# Altium schematic sheet FP2_A_TTypeFBTxs.SchDoc
size A3; SheetNumber: 1; SheetTotal: 1
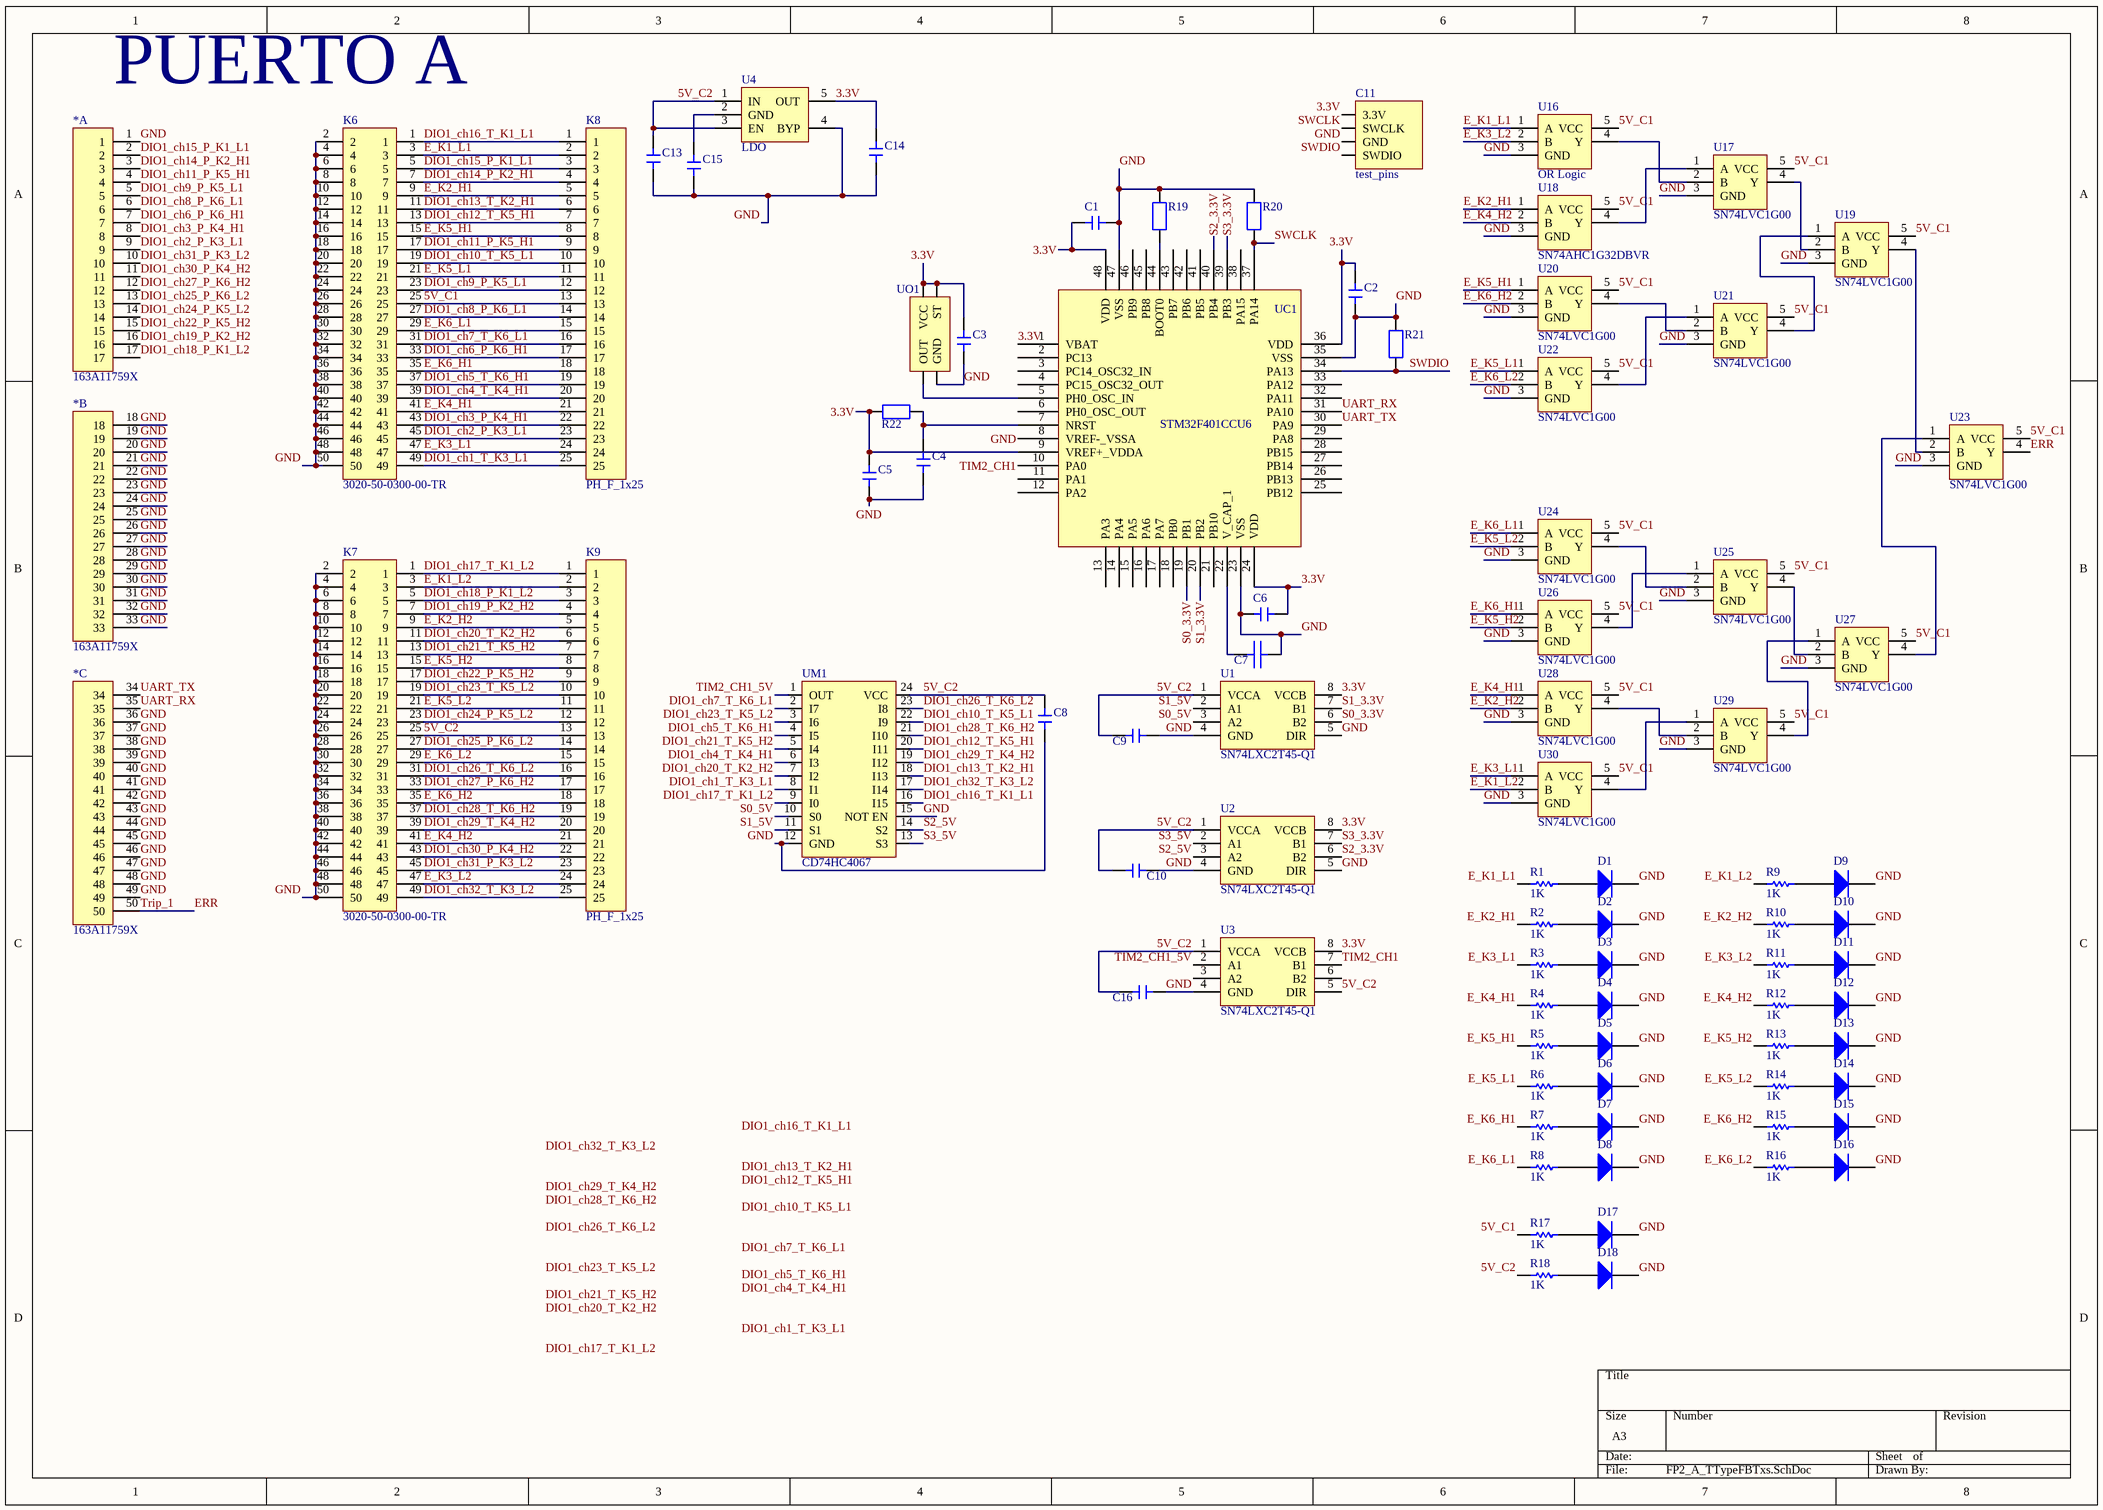
[diagram p0: FP2_A_TTypeFBTxs.SchDoc]

## Parts
(Parts that share a designator on the sheet are numbered #1, #2 ... from top to bottom, then left to right.)
*#1  163A11759X  [163A11759X]  (part A of 3)
*#2  163A11759X  [163A11759X]  (part B of 3)
*#3  163A11759X  [163A11759X]  (part C of 3)
C1  C_100nF  [CAPC1005X02N]  (value not drawn)
C2  C_100nF  [CAPC1005X02N]  (value not drawn)
C3  C_100nF  [CAPC1005X02N]  (value not drawn)
C4  C_100nF  [CAPC1005X02N]  (value not drawn)
C5  C_100nF  [CAPC1005X02N]  (value not drawn)
C6  C_100nF  [CAPC1005X02N]  (value not drawn)
C7  C_4.7uF  [CAPC1005X02N]  (value not drawn)
C8  C_100nF  [CAPC1005X02N]  (value not drawn)
C9  C_100nF  [CAPC1005X02N]  (value not drawn)
C10  C_100nF  [CAPC1005X02N]  (value not drawn)
C11  test_pins  [Test_pins]
C13  C_100nF  [CAPC1005X02N]  (value not drawn)
C14  C_100nF  [CAPC1005X02N]  (value not drawn)
C15  C_100nF  [CAPC1005X02N]  (value not drawn)
C16  C_100nF  [CAPC1005X02N]  (value not drawn)
D1  Diode  (value not drawn)
D2  Diode  (value not drawn)
D3  Diode  (value not drawn)
D4  Diode  (value not drawn)
D5  Diode  (value not drawn)
D6  Diode  (value not drawn)
D7  Diode  (value not drawn)
D8  Diode  (value not drawn)
D9  Diode  (value not drawn)
D10  Diode  (value not drawn)
D11  Diode  (value not drawn)
D12  Diode  (value not drawn)
D13  Diode  (value not drawn)
D14  Diode  (value not drawn)
D15  Diode  (value not drawn)
D16  Diode  (value not drawn)
D17  Diode  (value not drawn)
D18  Diode  (value not drawn)
K6  3020-50-0300-00-TR  [IDC_2x50]
K7  3020-50-0300-00-TR  [IDC_2x50]
K8  PH_F_1x25  [PH_F_1x25]
K9  PH_F_1x25  [PH_F_1x25]
R1  value 1K  (hidden comment: Resistor)
R2  value 1K  (hidden comment: Resistor)
R3  value 1K  (hidden comment: Resistor)
R4  value 1K  (hidden comment: Resistor)
R5  value 1K  (hidden comment: Resistor)
R6  value 1K  (hidden comment: Resistor)
R7  value 1K  (hidden comment: Resistor)
R8  value 1K  (hidden comment: Resistor)
R9  value 1K  (hidden comment: Resistor)
R10  value 1K  (hidden comment: Resistor)
R11  value 1K  (hidden comment: Resistor)
R12  value 1K  (hidden comment: Resistor)
R13  value 1K  (hidden comment: Resistor)
R14  value 1K  (hidden comment: Resistor)
R15  value 1K  (hidden comment: Resistor)
R16  value 1K  (hidden comment: Resistor)
R17  value 1K  (hidden comment: Resistor)
R18  value 1K  (hidden comment: Resistor)
R19  R_40kOhm  [Resist]  (value not drawn)
R20  R_40kOhm  [Resist]  (value not drawn)
R21  R_40kOhm  [Resist]  (value not drawn)
R22  R_40kOhm  [Resist]  (value not drawn)
U1  SN74LXC2T45-Q1  [SN74LXC2T45-Q1]
U2  SN74LXC2T45-Q1  [SN74LXC2T45-Q1]
U3  SN74LXC2T45-Q1  [SN74LXC2T45-Q1]
U4  LDO  [LDK120-5N-200mA]
U16  OR Logic  [sot23]
U17  SN74LVC1G00  [sot23]
U18  SN74AHC1G32DBVR  [sot23]
U19  SN74LVC1G00  [sot23]
U20  SN74LVC1G00  [sot23]
U21  SN74LVC1G00  [sot23]
U22  SN74LVC1G00  [sot23]
U23  SN74LVC1G00  [sot23]
U24  SN74LVC1G00  [sot23]
U25  SN74LVC1G00  [sot23]
U26  SN74LVC1G00  [sot23]
U27  SN74LVC1G00  [sot23]
U28  SN74LVC1G00  [sot23]
U29  SN74LVC1G00  [sot23]
U30  SN74LVC1G00  [sot23]
UC1  STM32F401CCU6  [STM32F401CCU6-UFQFPN48]
UM1  CD74HC4067  [CD74HC4067SM96]
UO1  Oscil SG-210STF 25MHz  [SG-210STF-25.0000M]  (value not drawn)

## Nets
3.3V: C1.1 C2.2 C3.2 C5.2 C6.1 C11.1(3.3V) C14.1 R22.2 U1.8(VCCB) U2.8(VCCB) U3.8(VCCB) U4.5(OUT) UC1.1(VBAT) UC1.9(VREF+_VDDA) UC1.24(VDD) UC1.36(VDD) UC1.48(VDD) UO1.1(ST) UO1.4(VCC)
5V_C1: K6.25 K8.13 R17.1 U16.5(VCC) U17.5(VCC) U18.5(VCC) U19.5(VCC) U20.5(VCC) U21.5(VCC) U22.5(VCC) U23.5(VCC) U24.5(VCC) U25.5(VCC) U26.5(VCC) U27.5(VCC) U28.5(VCC) U29.5(VCC) U30.5(VCC)
5V_C2: C8.1 C9.2 C10.2 C13.1 C16.2 K7.25 K9.13 R18.1 U1.1(VCCA) U2.1(VCCA) U3.1(VCCA) U3.5(DIR) U4.1(IN) U4.3(EN) UM1.24(VCC)
DIO1_ch1_T_K3_L1: K6.49 K8.25 UM1.8(I1)
DIO1_ch2_P_K3_L1: *#1.9 K6.45 K8.23
DIO1_ch3_P_K4_H1: *#1.8 K6.43 K8.22
DIO1_ch4_T_K4_H1: K6.39 K8.20 UM1.6(I3)
DIO1_ch5_T_K6_H1: K6.37 K8.19 UM1.4(I5)
DIO1_ch6_P_K6_H1: *#1.7 K6.33 K8.17
DIO1_ch7_T_K6_L1: K6.31 K8.16 UM1.2(I7)
DIO1_ch8_P_K6_L1: *#1.6 K6.27 K8.14
DIO1_ch9_P_K5_L1: *#1.5 K6.23 K8.12
DIO1_ch10_T_K5_L1: K6.19 K8.10 UM1.22(I9)
DIO1_ch11_P_K5_H1: *#1.4 K6.17 K8.9
DIO1_ch12_T_K5_H1: K6.13 K8.7 UM1.20(I11)
DIO1_ch13_T_K2_H1: K6.11 K8.6 UM1.18(I13)
DIO1_ch14_P_K2_H1: *#1.3 K6.7 K8.4
DIO1_ch15_P_K1_L1: *#1.2 K6.5 K8.3
DIO1_ch16_T_K1_L1: K6.1 K8.1 UM1.16(I15)
DIO1_ch17_T_K1_L2: K7.1 K9.1 UM1.9(I0)
DIO1_ch18_P_K1_L2: *#1.17 K7.5 K9.3
DIO1_ch19_P_K2_H2: *#1.16 K7.7 K9.4
DIO1_ch20_T_K2_H2: K7.11 K9.6 UM1.7(I2)
DIO1_ch21_T_K5_H2: K7.13 K9.7 UM1.5(I4)
DIO1_ch22_P_K5_H2: *#1.15 K7.17 K9.9
DIO1_ch23_T_K5_L2: K7.19 K9.10 UM1.3(I6)
DIO1_ch24_P_K5_L2: *#1.14 K7.23 K9.12
DIO1_ch25_P_K6_L2: *#1.13 K7.27 K9.14
DIO1_ch26_T_K6_L2: K7.31 K9.16 UM1.23(I8)
DIO1_ch27_P_K6_H2: *#1.12 K7.33 K9.17
DIO1_ch28_T_K6_H2: K7.37 K9.19 UM1.21(I10)
DIO1_ch29_T_K4_H2: K7.39 K9.20 UM1.19(I12)
DIO1_ch30_P_K4_H2: *#1.11 K7.43 K9.22
DIO1_ch31_P_K3_L2: *#1.10 K7.45 K9.23
DIO1_ch32_T_K3_L2: K7.49 K9.25 UM1.17(I14)
E_K1_L1: K6.3 K8.2 R1.1 U16.1(A)
E_K1_L2: K7.3 K9.2 R9.1 U30.2(B)
E_K2_H1: K6.9 K8.5 R2.1 U18.1(A)
E_K2_H2: K7.9 K9.5 R10.1 U28.2(B)
E_K3_L1: K6.47 K8.24 R3.1 U30.1(A)
E_K3_L2: K7.47 K9.24 R11.1 U16.2(B)
E_K4_H1: K6.41 K8.21 R4.1 U28.1(A)
E_K4_H2: K7.41 K9.21 R12.1 U18.2(B)
E_K5_H1: K6.15 K8.8 R5.1 U20.1(A)
E_K5_H2: K7.15 K9.8 R13.1 U26.2(B)
E_K5_L1: K6.21 K8.11 R6.1 U22.1(A)
E_K5_L2: K7.21 K9.11 R14.1 U24.2(B)
E_K6_H1: K6.35 K8.18 R7.1 U26.1(A)
E_K6_H2: K7.35 K9.18 R15.1 U20.2(B)
E_K6_L1: K6.29 K8.15 R8.1 U24.1(A)
E_K6_L2: K7.29 K9.15 R16.1 U22.2(B)
ERR: *#3.50 U23.4(Y)  [also labelled Trip_1]
GND: *#1.1 *#2.18 *#2.19 *#2.20 *#2.21 *#2.22 *#2.23 *#2.24 *#2.25 *#2.26 *#2.27 *#2.28 *#2.29 *#2.30 *#2.31 *#2.32 *#2.33 *#3.36 *#3.37 *#3.38 *#3.39 *#3.40 *#3.41 *#3.42 *#3.43 *#3.44 *#3.45 *#3.46 *#3.47 *#3.48 *#3.49 C1.2 C2.1 C3.1 C4.1 C5.1 C6.2 C7.2 C8.2 C9.1 C10.1 C11.3(GND) C13.2 C14.2 C15.2 C16.1 D1.2(K) D2.2(K) D3.2(K) D4.2(K) D5.2(K) D6.2(K) D7.2(K) D8.2(K) D9.2(K) D10.2(K) D11.2(K) D12.2(K) D13.2(K) D14.2(K) D15.2(K) D16.2(K) D17.2(K) D18.2(K) K6.2 K6.4 K6.6 K6.8 K6.10 K6.12 K6.14 K6.16 K6.18 K6.20 K6.22 K6.24 K6.26 K6.28 K6.30 K6.32 K6.34 K6.36 K6.38 K6.40 K6.42 K6.44 K6.46 K6.48 K6.50 K7.2 K7.4 K7.6 K7.8 K7.10 K7.12 K7.14 K7.16 K7.18 K7.20 K7.22 K7.24 K7.26 K7.28 K7.30 K7.32 K7.34 K7.36 K7.38 K7.40 K7.42 K7.44 K7.46 K7.48 K7.50 R19.2 R20.2 R21.2 U1.4(GND) U1.5(DIR) U2.4(GND) U2.5(DIR) U3.4(GND) U4.4(BYP) U16.3(GND) U17.3(GND) U18.3(GND) U19.3(GND) U20.3(GND) U21.3(GND) U22.3(GND) U23.3(GND) U24.3(GND) U25.3(GND) U26.3(GND) U27.3(GND) U28.3(GND) U29.3(GND) U30.3(GND) UC1.8(VREF-_VSSA) UC1.23(VSS) UC1.35(VSS) UC1.47(VSS) UM1.12(GND) UM1.15(NOT_EN) UO1.2(GND)
S0_3.3V: U1.6(B2) UC1.19(PB1)
S0_5V: U1.3(A2) UM1.10(S0)
S1_3.3V: U1.7(B1) UC1.20(PB2)
S1_5V: U1.2(A1) UM1.11(S1)
S2_3.3V: U2.6(B2) UC1.40(PB4)
S2_5V: U2.3(A2) UM1.14(S2)
S3_3.3V: U2.7(B1) UC1.39(PB3)
S3_5V: U2.2(A1) UM1.13(S3)
SWCLK: C11.2(SWCLK) R20.1 UC1.37(PA14)
SWDIO: C11.4(SWDIO) R21.1 UC1.34(PA13)
TIM2_CH1: U3.7(B1) UC1.10(PA0)
TIM2_CH1_5V: U3.2(A1) UM1.1(OUT)
UART_RX: *#3.35 UC1.31(PA10)
UART_TX: *#3.34 UC1.30(PA9)
NetC4_2: C4.2 R22.1 UC1.7(NRST)
NetC7_1: C7.1 UC1.22(V_CAP_1)
NetC15_1: C15.1 U4.2(GND)
NetD1_1: D1.1(A) R1.2
NetD2_1: D2.1(A) R2.2
NetD3_1: D3.1(A) R3.2
NetD4_1: D4.1(A) R4.2
NetD5_1: D5.1(A) R5.2
NetD6_1: D6.1(A) R6.2
NetD7_1: D7.1(A) R7.2
NetD8_1: D8.1(A) R8.2
NetD9_1: D9.1(A) R9.2
NetD10_1: D10.1(A) R10.2
NetD11_1: D11.1(A) R11.2
NetD12_1: D12.1(A) R12.2
NetD13_1: D13.1(A) R13.2
NetD14_1: D14.1(A) R14.2
NetD15_1: D15.1(A) R15.2
NetD16_1: D16.1(A) R16.2
NetD17_1: D17.1(A) R17.2
NetD18_1: D18.1(A) R18.2
NetR19_1: R19.1 UC1.44(BOOT0)
NetU16_4: U16.4(Y) U17.2(B)
NetU17_1: U17.1(A) U18.4(Y)
NetU17_4: U17.4(Y) U19.2(B)
NetU19_1: U19.1(A) U21.4(Y)
NetU19_4: U19.4(Y) U23.2(B)
NetU20_4: U20.4(Y) U21.2(B)
NetU21_1: U21.1(A) U22.4(Y)
NetU23_1: U23.1(A) U27.4(Y)
NetU24_4: U24.4(Y) U25.2(B)
NetU25_1: U25.1(A) U26.4(Y)
NetU25_4: U25.4(Y) U27.2(B)
NetU27_1: U27.1(A) U29.4(Y)
NetU28_4: U28.4(Y) U29.2(B)
NetU29_1: U29.1(A) U30.4(Y)
NetUC1_5: UC1.5(PH0_OSC_IN) UO1.3(OUT)

Not connected (* = marked no-connect by the designer): U3 3(A2) 6(B2); UC1 2(PC13) 3(PC14_OSC32_IN) 4(PC15_OSC32_OUT) 6(PH0_OSC_OUT) 11(PA1) 12(PA2) 13(PA3) 14(PA4) 15(PA5) 16(PA6) 17(PA7) 18(PB0) 21(PB10) 25(PB12) 26(PB13) 27(PB14) 28(PB15) 29(PA8) 32(PA11) 33(PA12) 38(PA15) 41(PB5) 42(PB6) 43(PB7) 45(PB8) 46(PB9)

## Notes on the sheet
- PUERTO A
- Labels drawn without touching a wire or pin: DIO1_ch1_T_K3_L1, DIO1_ch4_T_K4_H1, DIO1_ch5_T_K6_H1, DIO1_ch7_T_K6_L1, DIO1_ch10_T_K5_L1, DIO1_ch12_T_K5_H1, DIO1_ch13_T_K2_H1, DIO1_ch16_T_K1_L1, DIO1_ch17_T_K1_L2, DIO1_ch20_T_K2_H2, DIO1_ch21_T_K5_H2, DIO1_ch23_T_K5_L2, DIO1_ch26_T_K6_L2, DIO1_ch28_T_K6_H2, DIO1_ch29_T_K4_H2, DIO1_ch32_T_K3_L2

## Library data of the parts
D1-D18 = Diode: AF: 1; BV: 0; BV_MAX: 1e99; EG: 1.11; FC: 0.5; IBV: 0.001; ISR: 1e-14; MJSW: 0.33; NTUN: 30; TNOM: 27; XTI: 3; SimulationGenericComponent: True; CJO: 0; CJP: 0; CTA: 0; CTP: 0; FCS: 0.5; FV_MAX: 1e99; IKF: 0; IKR: 0; JSW: 0; JTUN: 0; JTUNSW: 0; KEG: 1; KF: 0; LEVEL: 1; N: 1; NBV: 1; NR: 1; NS: 1; PHP: 1; RS: 0; TCV: 0; TLEV: 0; TLEVC: 0; TM1: 0; TM2: 0; TPB: 0; TPHP: 0; TRS: 0; TRS2: 0; TT: 0; TTT1: 0; TTT2: 0; VJ: 1; XTITUN: 3; IS: 1e-14
R1-R18 = Resistor: TC1: 0; SimulationGenericComponent: True; TC2: 0
U16 = SN74AHC1G32DBVR